# EasyEDA Pro project ProProject_校电赛c题第二版_2024-10-13.epro, board _1
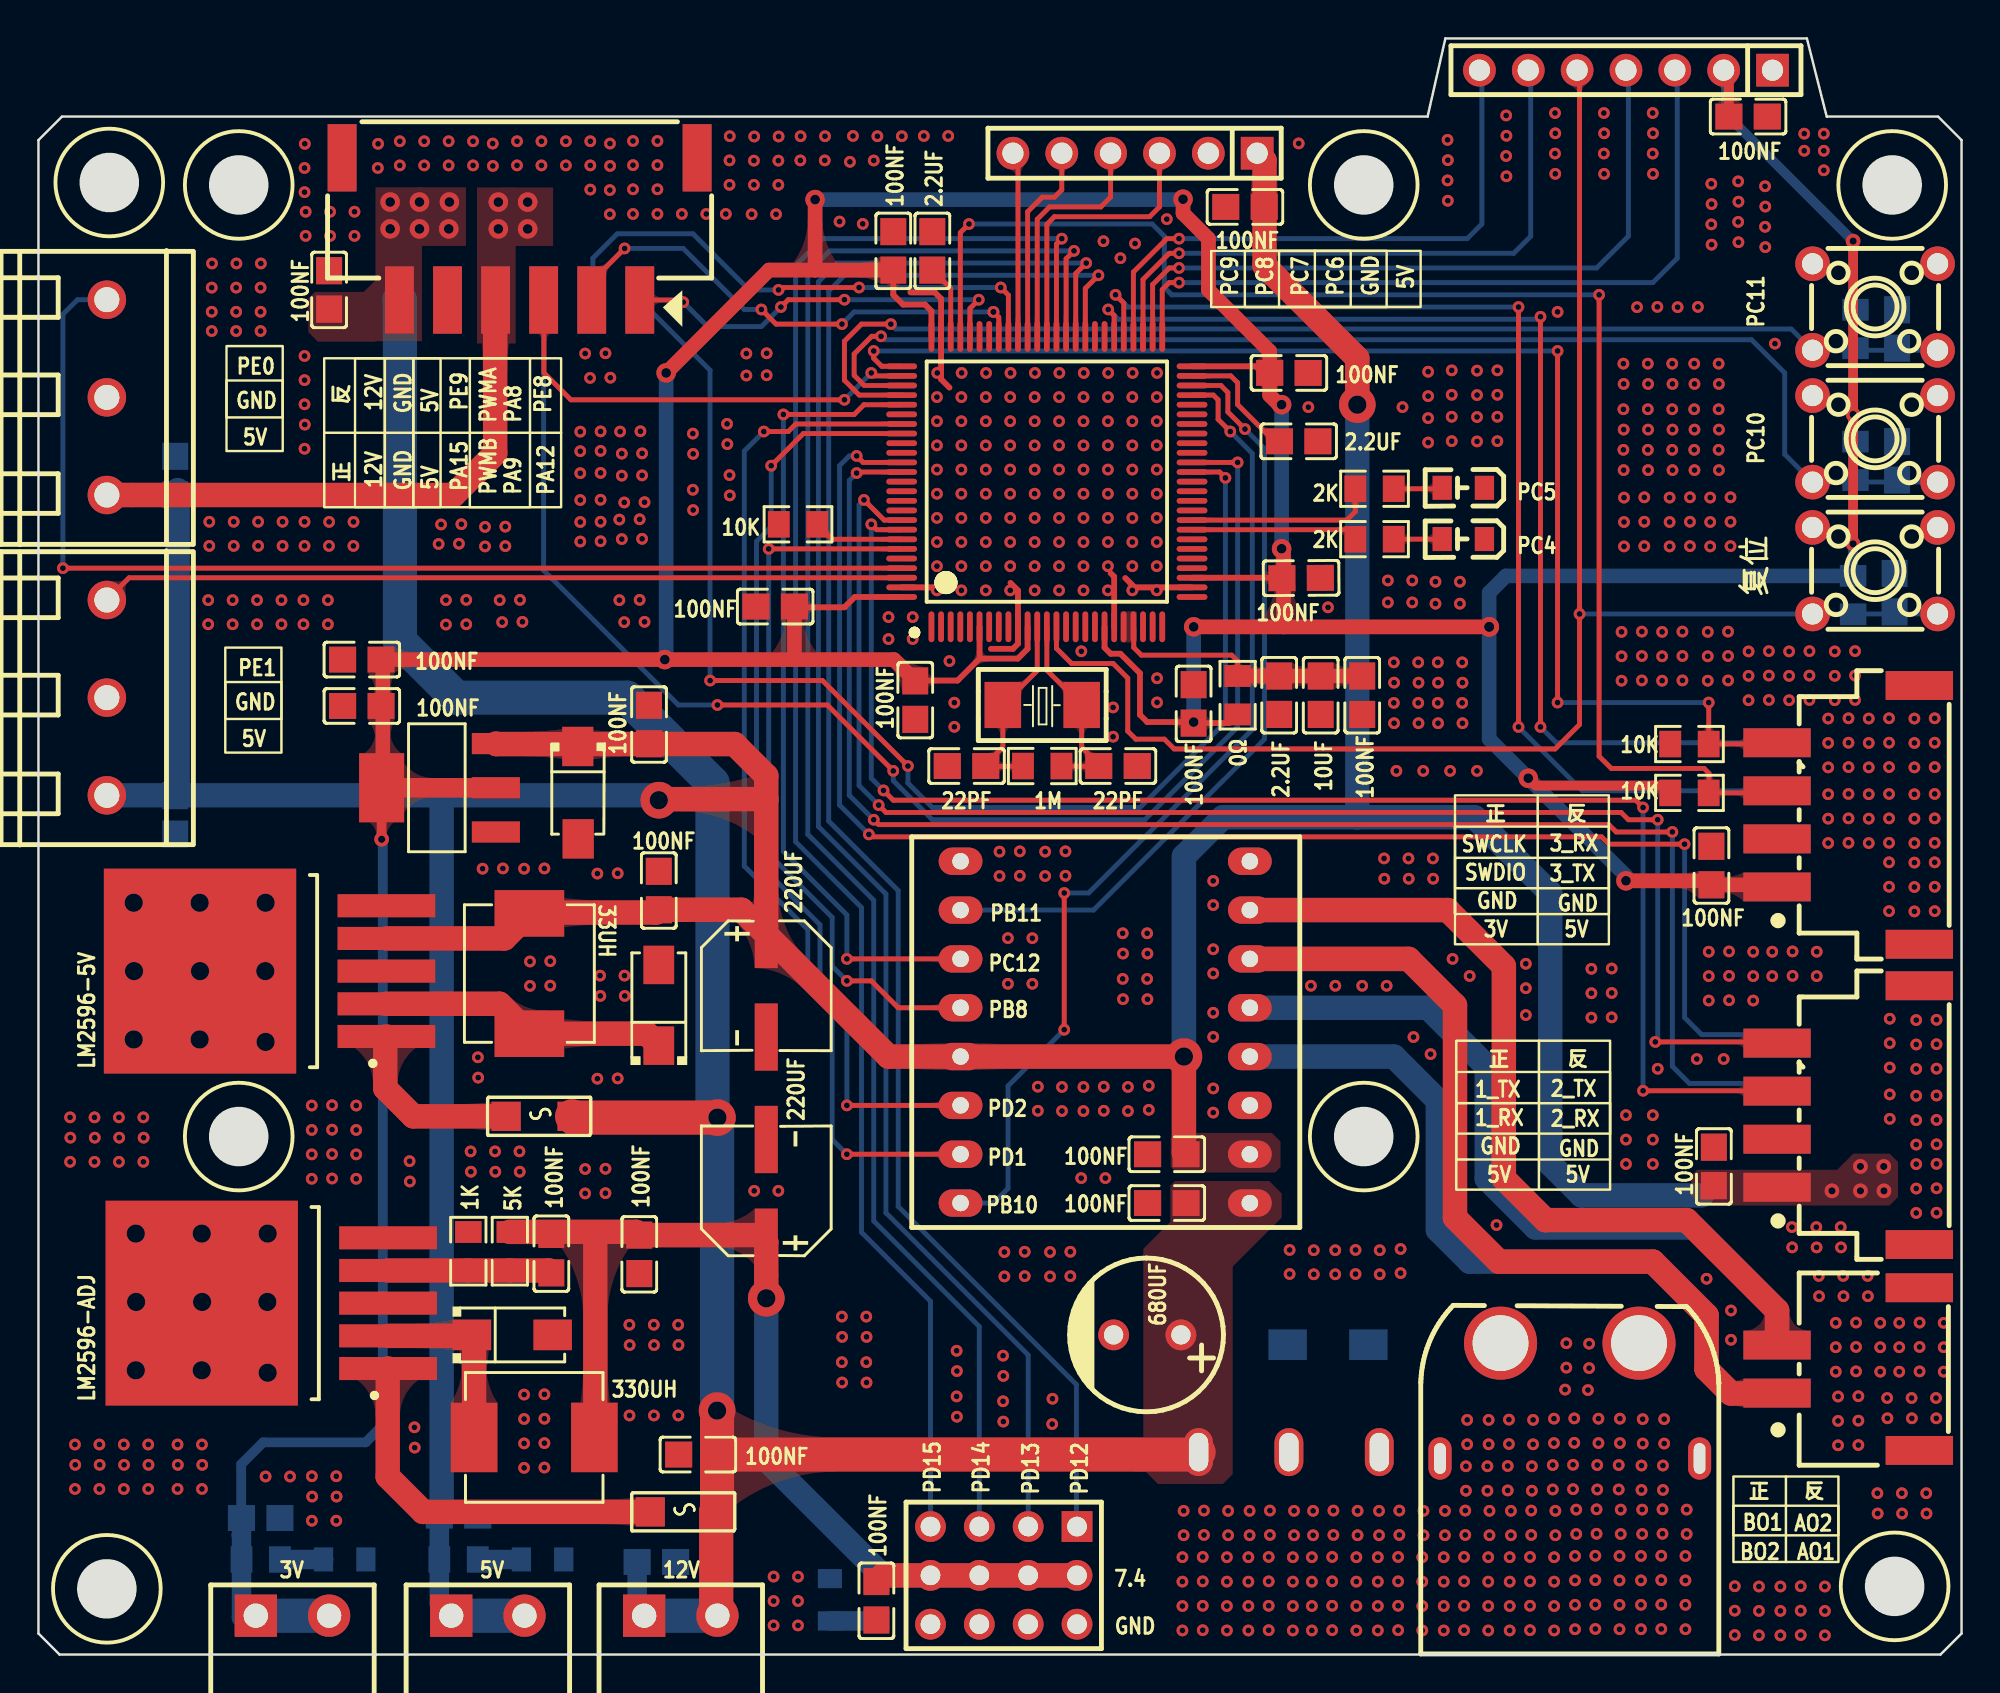
[diagram p0: board, top side]
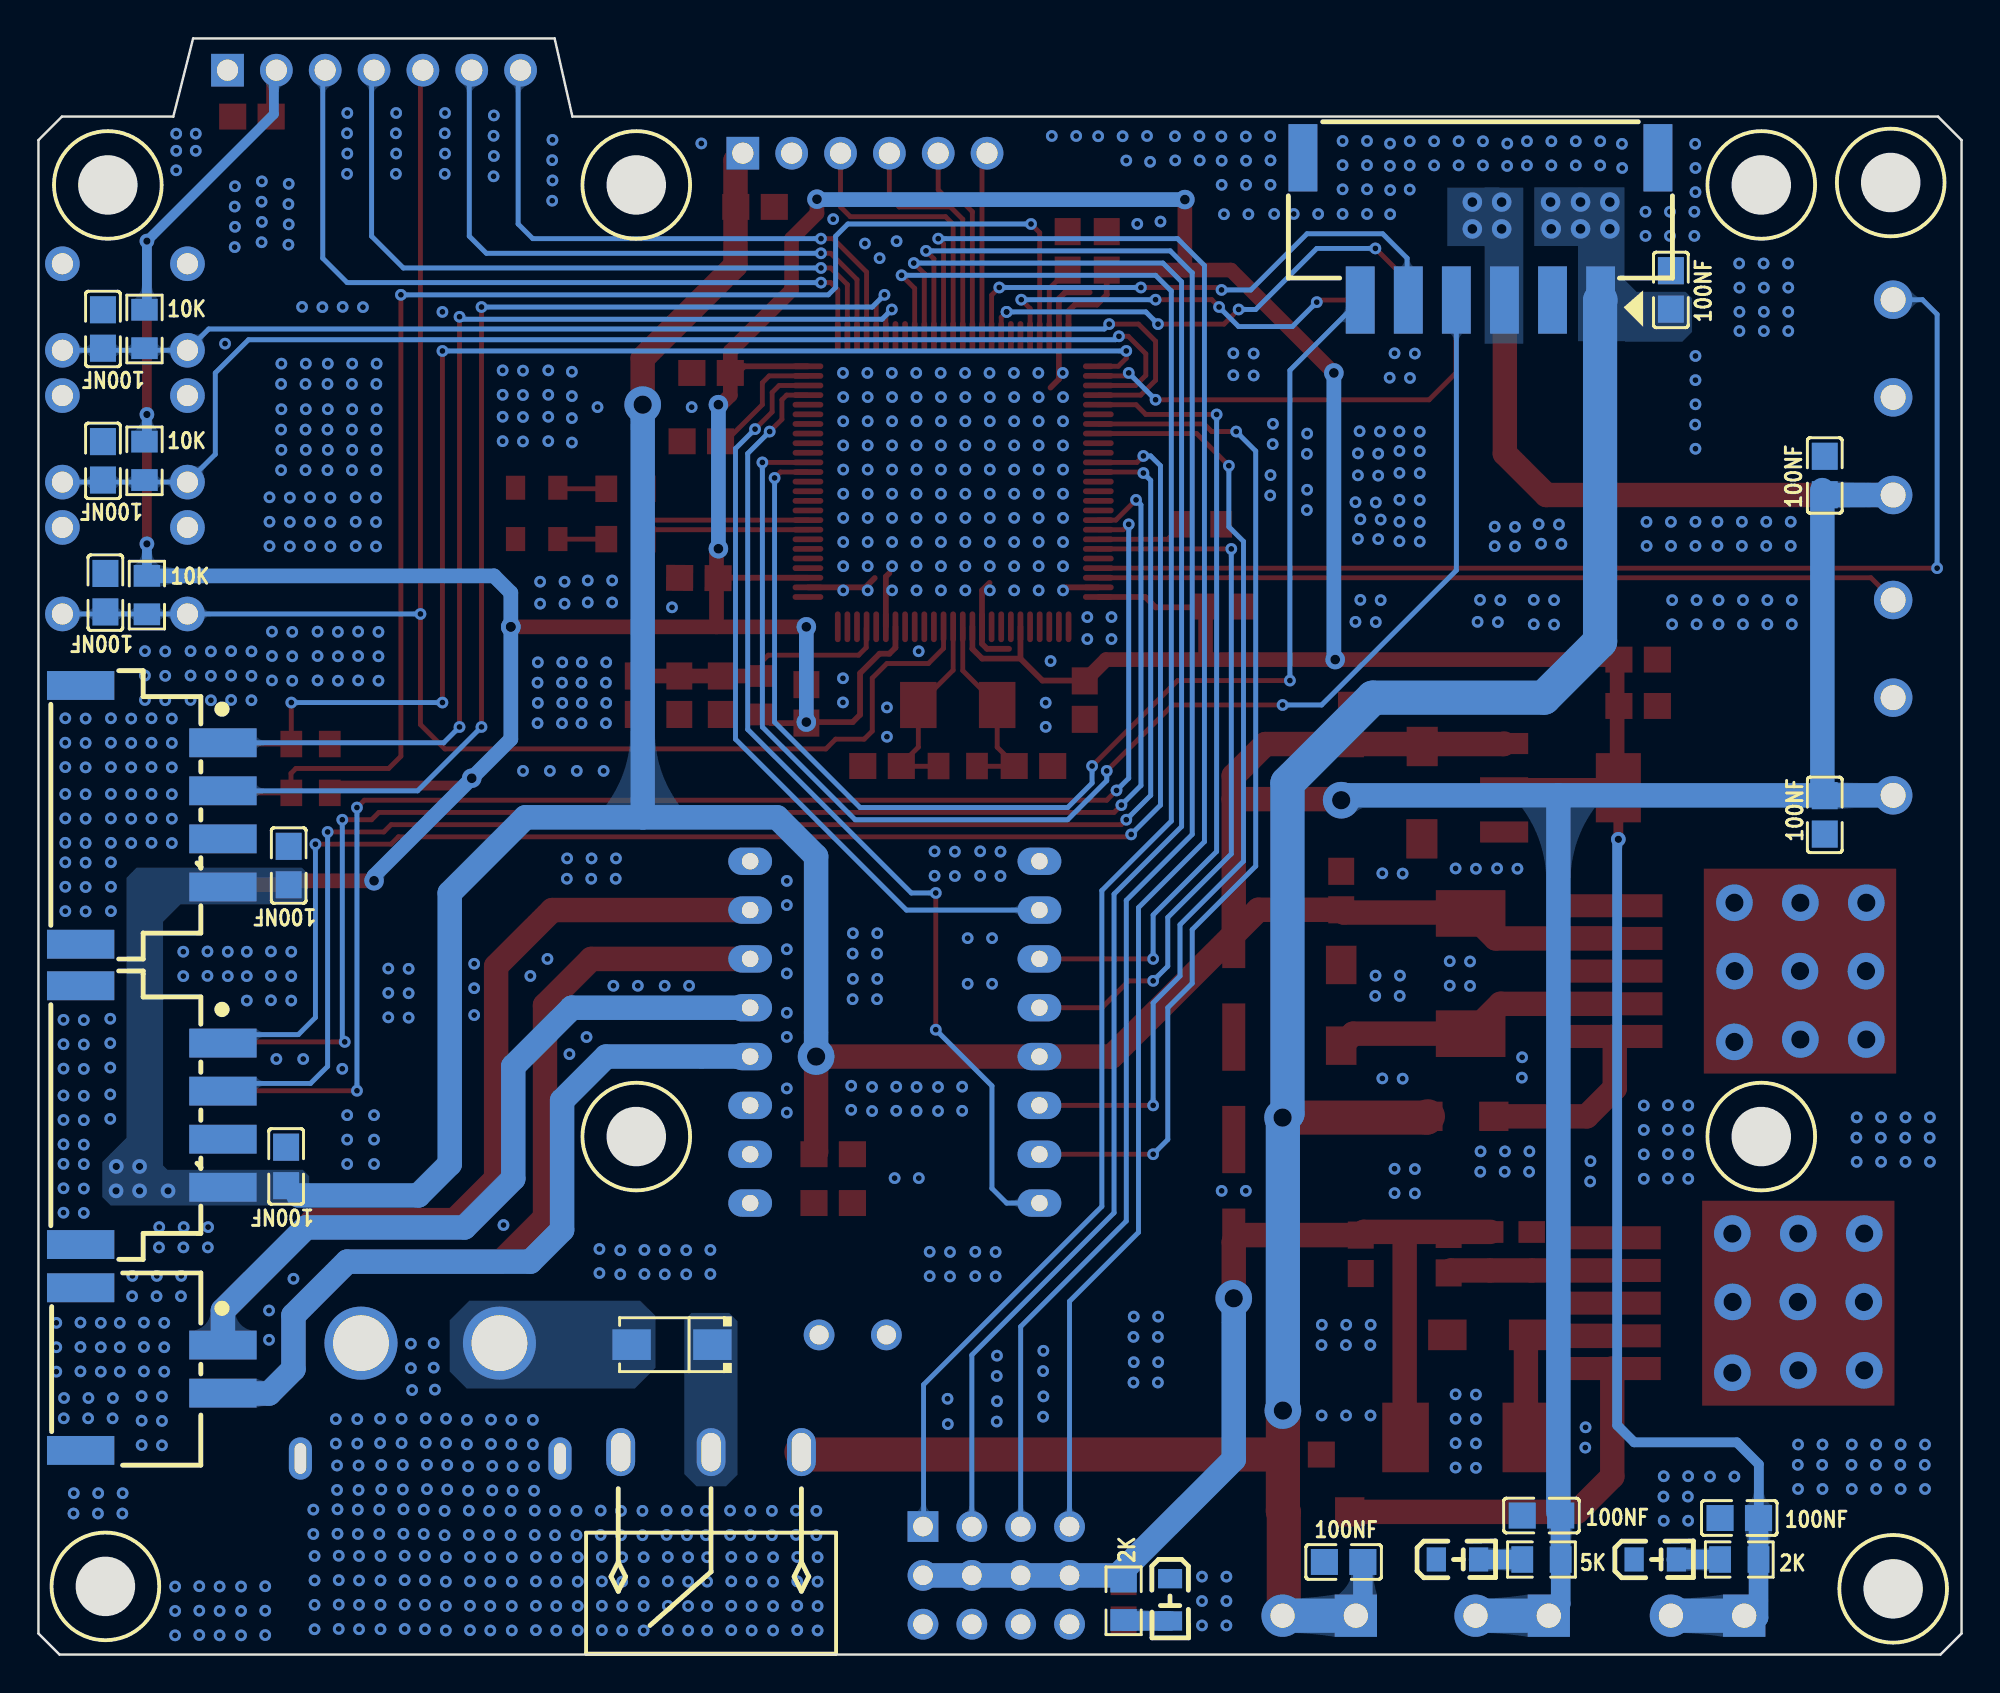
[diagram p1: board, bottom side, seen from below]

Outline 100 x 84.06 mm; copper layers: Top Layer, Bottom Layer. Coordinates in mm from the lower left corner of the outline.
Outline path: 0,78.78 1.22,80 72.24,80 73.16,84.06 91.96,84.06 92.99,80 98.78,80 100,78.78 100,1.09 98.91,0 1.09,0 0,1.09 0,78.78
Stack: Top Layer 0.035mm / Dielectric1 1.51mm FR4 er 4.5 / Bottom Layer 0.035mm

## Design rules (mm)
template: JLCPCB Capability(Two Layers Board)
spacing copperThickness1oz (default): track to track 0.102, other pairs 0.152 to 0.3
spacing copperThickness2oz: track to track 0.203, other pairs 0.152 to 0.3
track width copperThickness1oz (default): min 0.127, default 0.254, max 2.54
track width copperThickness2oz: min 0.203, default 0.254, max 2.54
differential pair differentialPair (default): width min 0.127, default 0.254, max 2.54; gap min 0.152, default 0.152
via viaSize (default): diameter min 0.5, default 0.61, max 10; hole min 0.3, default 0.305, max 6.3

## Placement (name value [footprint] x y rotation side)
0  0  [R0805]  62.36 49.9 90 top
1K1  1K  [R0805]  22.35 20.98 270 top
1M  1M  [R0805]  52.2 46.22 0 top
2  LM2596-5V  [lm2596]  15.02 34.92 180 top
2.2u  -  [C0805]  46.48 73.02 270 top
2.2u#2  -  [C0805]  65.53 63.11 180 top
2.2u#3  -  [C0805]  64.52 49.9 90 top
2K  -  [R0805]  69.47 60.64 0 top
2K1  2k  [R0805]  43.57 2.8 270 bottom
2K#2  -  [R0805]  69.47 58.02 0 top
2K#3  -  [R0805]  11.56 4.94 0 bottom
5  LM2596-ADJ  [lm2596-adj]  13.84 18.41 180 top
5K  5k  [R0805]  21.84 4.94 0 bottom
5K1  5K  [R0805]  24.51 20.98 90 top
10k  -  [R0805]  85.85 44.82 180 top
10K  10K  [R0805]  39.5 58.79 180 top
10k1  10K  [R0805]  94.36 55.11 270 bottom
10K5  10K  [R0805]  94.49 62.09 270 bottom
10K6  10K  [R0805]  94.49 68.95 270 bottom
10k#2  -  [R0805]  85.85 47.36 180 top
22p  -  [C0805]  48.26 46.22 0 top
22p#2  -  [C0805]  56.13 46.22 180 top
33uH1  33uH  [IND-SMD_L7.0-W6.6_FXL0630]  25.53 35.42 270 top
33uH2  330uH  [IND-SMD_L7.0-W6.6_FXL0630]  25.78 11.29 180 top
100nf  -  [C0805]  62.74 75.3 180 top
100NF  -  [C0805]  68.83 49.9 90 top
100NF1  100nF  [C0805]  32.13 4.82 180 bottom
100nf7  100nF  [C0805]  16.82 51.75 0 top
100nf8  100nF  [C0805]  32.26 39.74 270 top
100nf9  100nF  [C0805]  34.29 10.4 0 top
100nf10  100nF  [C0805]  26.67 20.85 90 top
100nf11  100nF  [C0805]  31.24 20.82 90 top
100nf13  100nF  [C0805]  58.67 23.48 180 top
100NF13  100nF  [C0805]  96.65 62.09 90 bottom
100nf14  100nF  [C0805]  58.67 26.03 180 top
100NF14  100nF  [C0805]  96.65 68.95 90 bottom
100NF15  100nF  [C0805]  88.9 80 180 top
100nf15  100nF  [C0805]  7.11 61.33 90 bottom
100nf16  100nF  [C0805]  43.57 2.8 90 top
100nf20  100nF  [C0805]  31.75 48.38 270 top
100nf21  10UF  [C0805]  16.82 49.34 0 top
100nf22  100nF  [C0805]  7.11 43.68 90 bottom
100nf#2  -  [C0805]  87.12 25.39 90 top
100NF#2  -  [C0805]  96.52 55.23 90 bottom
100nf#3  -  [C0805]  87 41.04 90 top
100NF#3  -  [C0805]  87.12 25.39 270 bottom
100nf#4  -  [C0805]  38.31 54.51 180 top
100NF#4  -  [C0805]  86.99 41.04 270 bottom
100nf#5  -  [C0805]  44.45 73.02 90 top
100NF#5  -  [C0805]  11.56 7.1 180 bottom
100nf#6  -  [C0805]  45.59 49.65 270 top
100NF#6  -  [C0805]  21.84 7.23 180 bottom
100nf#7  -  [C0805]  15.11 70.98 90 top
100nf#8  -  [C0805]  60.07 49.45 90 top
100nf#9  -  [C0805]  65.66 56 180.4 top
100nf#10  -  [C0805]  15.11 70.98 90 bottom
106  106  [C0805]  66.68 49.9 90 top
677  STM32F407V  [lqfp-100_l14.0-w14.0-p0.50-ls16.0-bl]  52.44 61.01 0 top
C37  100nF  [C0805]  65.02 66.67 0 top
C39  220UF  [CAP-SMD_BD6.3-L6.6-W6.6-FD]  37.85 34.79 270 top
C40  220UF  [CAP-SMD_BD6.3-L6.6-W6.6-FD]  37.85 24.12 90 top
C43  680uF  [CAP-TH_BD8.0-P3.50-D0.5-FD]  57.66 16.63 180 top
CN4  WAFER-254W-4A  [CONN-SMD_4P-P2.50-WAFER-254W-4P]  94.11 43.68 90 top
CN15  WAFER-254W-4A  [CONN-SMD_4P-P2.50-WAFER-254W-4P]  94.11 28.06 90 top
CN16  XT60PW-M  [CONN-TH_XT60PW-M]  79.63 13.2 90 top
CN17  WAFER-254W-4A  [CONN-SMD_4P-P2.50-WAFER-254W-4P]  94.11 43.68 270 bottom
CN18  WAFER-254W-4A  [CONN-SMD_4P-P2.50-WAFER-254W-4P]  94.11 28.06 270 bottom
CN19  ZX-XH2.54-2PWT  [CONN-SMD_2P-P2.54_MEGASTAR_ZX-XH2.54-2PWT]  94.11 14.85 270 bottom
CN20  ZX-XH2.54-2PWT  [CONN-SMD_2P-P2.54_MEGASTAR_ZX-XH2.54-2PWT]  94.11 14.85 90 top
D1  SS54  [SMA_L4.3-W2.6-LS5.0-RD]  28.06 44.83 270 top
FU1  3A  [3a熔断器]  26.04 27.8 180 top
FU2  3A  [3a熔断器]  33.53 7.23 180 top
H10  -  [HDR-TH_7P-P2.54-V-M]  82.55 82.41 180 top
H11  PZ254V-11-06P  [HDR-TH_6P-P2.54-V-M]  57.02 78.09 180 top
LED1  -  [LED_0805]  15.88 4.94 180 bottom
LED2  -  [LED_0805]  26.16 4.94 180 bottom
LED3  -  [LED_0805]  41.16 2.8 270 bottom
P1  WJ500V-5.08-3P  [CONN-TH_3P-P5.00_WJ500V-5.08-3P]  3.56 65.39 270 top
P2  WJ500V-5.08-3P  [CONN-TH_3P-P5.00_WJ500V-5.08-3P]  3.56 49.77 270 top
P3  WJ15EDGRC-3.81-2P  [CONN-TH_2P-P3.81_WJ15EDGRC-3.81-2P]  33.4 2.02 0 top
P4  WJ15EDGRC-3.81-2P  [CONN-TH_2P-P3.81_WJ15EDGRC-3.81-2P]  23.37 2.02 0 top
P5  WJ15EDGRC-3.81-2P  [CONN-TH_2P-P3.81_WJ15EDGRC-3.81-2P]  13.21 2.02 0 top
PC4  -  [LED_0805]  74.04 58.03 180 top
PC5  -  [LED_0805]  74.04 60.7 180 top
RESET1  K2-1102DP-C4SW-04  [KEY-TH_4P-L6.0-W6.0-P4.50-LS6.5]  95.5 56.38 0 top
RESET2  K2-1102DP-C4SW-04  [KEY-TH_4P-L6.0-W6.0-P4.50-LS6.5]  95.5 63.24 0 top
RESET3  K2-1102DP-C4SW-04  [KEY-TH_4P-L6.0-W6.0-P4.50-LS6.5]  95.5 70.09 0 top
S1  单刀双掷  [弯]  65.02 3.04 90 bottom
SS1  SS34  [SMA_L4.3-W2.5-LS5.0-RD]  67.06 16.12 0 bottom
ss34  SS34  [SMA_L4.3-W2.5-LS5.0-RD]  24.64 16.63 0 top
SS34  SS34  [SMA_L4.3-W2.5-LS5.0-RD]  32.26 33.77 90 top
TB2  TB6612-MOD  [tb6612fng封装]  55.5 32.38 180 top
TP1  M3铜柱带丝印  [M3铜柱]  3.56 3.42 0 top
TP2  M3铜柱带丝印  [M3铜柱]  3.68 76.57 0 top
TP3  M3铜柱带丝印  [M3铜柱]  96.39 76.44 0 top
TP4  M3铜柱带丝印  [M3铜柱]  96.52 3.55 0 top
TP5  M3铜柱带丝印  [M3铜柱]  10.41 26.94 0 top
TP6  M3铜柱带丝印  [M3铜柱]  68.91 76.44 0 top
TP7  M3铜柱带丝印  [M3铜柱]  68.91 26.94 0 top
TP8  M3铜柱带丝印  [M3铜柱]  10.41 76.44 0 top
U5  AMS1117-3.3  [SOT-223-3_L6.5-W3.4-P2.30-LS7.0-BR]  20.82 45.09 0 top
U6  KH-2.54PH180-3X4P-L11.5  [HDR-TH-12P-P2.54-V-M-R3-C4-S5.08]  50.19 4.12 180 top
X1  8MHz  [CRYSTAL-SMD_L5.0-W3.2]  52.2 49.39 0 top
电机A2  BX-XH2.54-6PWT  [CONN-SMD_6P-P2.50_BX-XH2.54-6PWT]  25.02 74.16 0 bottom
电机A3  BX-XH2.54-6PWT  [CONN-SMD_6P-P2.50_BX-XH2.54-6PWT]  25.02 74.16 180 top

## Footprints (pads in the part's own frame, mm; a bottom-side part is the same pattern mirrored in y, then rotated)
3a熔断器
  rect 1.524x1.524 smd: 1(-1.714,-0.194) 2(1.714,-0.194)
C0805
  rect 1.41x1.35 smd: 1(-1,0) 2(1,0)
CAP-SMD_BD6.3-L6.6-W6.6-FD
  rect 3.5x1.2 smd: 1(-2.67,0) 2(2.67,0)
CAP-TH_BD8.0-P3.50-D0.5-FD
  round 1.6 hole 1: 1(-1.75,0) 2(1.75,0)
CONN-SMD_2P-P2.54_MEGASTAR_ZX-XH2.54-2PWT
  rect 1.5x3.5 smd: 1(-1.25,3.7) 2(1.25,3.7) 3(-4.23,-3.7) 4(4.23,-3.7)
CONN-SMD_4P-P2.50-WAFER-254W-4P
  rect 1.5x3.5 smd: 1(-3.75,3.7) 2(-1.25,3.7) 3(1.25,3.7) 4(3.75,3.7) 5(-6.73,-3.7) 6(6.73,-3.7)
CONN-SMD_6P-P2.50_BX-XH2.54-6PWT
  rect 1.5x3.5 smd: 1(-6.25,3.7) 2(-3.75,3.7) 3(-1.25,3.7) 4(1.25,3.7) 5(3.75,3.7) 6(6.25,3.7) 7(9.23,-3.7) 8(-9.23,-3.7)
CONN-TH_2P-P3.81_WJ15EDGRC-3.81-2P
  rect 2.2x2.2 hole 1.26: 1(-1.905,0)
  round 2.2 hole 1.26: 2(1.905,0)
CONN-TH_3P-P5.00_WJ500V-5.08-3P
  round 2 hole 1.3: 1(-5.08,0) 2(0,0) 3(5.08,0)
CONN-TH_XT60PW-M
  round 3.8 hole 2.9: 1(3,-3.6) 2(3,3.6)
  oval 2.2x1.2 hole 1.6x0.6: 3(-3,6.75) 4(-3,-6.75)
CRYSTAL-SMD_L5.0-W3.2
  rect 1.9x2.4 smd: 1(-2.05,0) 2(2.05,0)
HDR-TH-12P-P2.54-V-M-R3-C4-S5.08
  rect 1.6x1.6 hole 1.02: 1(-3.81,-2.54)
  round 1.6 hole 1.02: 2(-3.81,0) 3(-3.81,2.54) 4(-1.27,-2.54) 5(-1.27,0) 6(-1.27,2.54) 7(1.27,-2.54) 8(1.27,0) 9(1.27,2.54) 10(3.81,-2.54) 11(3.81,0) 12(3.81,2.54)
HDR-TH_6P-P2.54-V-M
  rect 1.7x1.7 hole 1.1: 1(-6.35,0)
  round 1.7 hole 1.1: 2(-3.81,0) 3(-1.27,0) 4(1.27,0) 5(3.81,0) 6(6.35,0)
HDR-TH_7P-P2.54-V-M
  rect 1.7x1.7 hole 1.1: 1(-7.62,0)
  round 1.7 hole 1.1: 2(-5.08,0) 3(-2.54,0) 4(0,0) 5(2.54,0) 6(5.08,0) 7(7.62,0)
IND-SMD_L7.0-W6.6_FXL0630
  rect 2.424x3.62 smd: 1(3.128,0) 2(-3.128,0)
KEY-TH_4P-L6.0-W6.0-P4.50-LS6.5
  round 1.8 hole 1.1: 1(-3.251,-2.251) 2(3.251,-2.251) 3(3.251,2.251) 4(-3.251,2.251)
LED_0805
  rect 1x1.25 smd: 1(-1.15,0.005) 2(1.05,0.005)
lm2596
  rect 5.08x1.2 smd: 1(-3.067,2.765) 2(-3.067,1.065) 3(-3.067,-0.635) 4(-3.067,-2.335) 5(-3.067,-4.035)
  rect 10x10.66 smd: 3(6.623,-0.635)
lm2596-adj
  rect 5.08x1.2 smd: 1(-4.337,3.527) 2(-4.337,1.827) 3(-4.337,0.127) 4(-4.337,-1.573) 5(-4.337,-3.273)
  rect 10x10.66 smd: 3(5.353,0.127)
lqfp-100_l14.0-w14.0-p0.50-ls16.0-bl
  oval 0.3x1.6 smd: 1(-6,-7.55) 2(-5.5,-7.55) 3(-5,-7.55) 4(-4.5,-7.55) 5(-4,-7.55) 6(-3.5,-7.55) 7(-3,-7.55) 8(-2.5,-7.55) 9(-2,-7.55) 10(-1.5,-7.55) 11(-1,-7.55) 12(-0.5,-7.55) 13(0,-7.55) 14(0.5,-7.55) 15(1,-7.55) 16(1.5,-7.55) 17(2,-7.55) 18(2.5,-7.55) 19(3,-7.55) 20(3.5,-7.55) 21(4,-7.55) 22(4.5,-7.55) 23(5,-7.55) 24(5.5,-7.55) 25(6,-7.55) 51(6,7.55) 52(5.5,7.55) 53(5,7.55) 54(4.5,7.55) 55(4,7.55) 56(3.5,7.55) 57(3,7.55) 58(2.5,7.55) 59(2,7.55) 60(1.5,7.55) 61(1,7.55) 62(0.5,7.55) 63(0,7.55) 64(-0.5,7.55) 65(-1,7.55) 66(-1.5,7.55) 67(-2,7.55) 68(-2.5,7.55) 69(-3,7.55) 70(-3.5,7.55) 71(-4,7.55) 72(-4.5,7.55) 73(-5,7.55) 74(-5.5,7.55) 75(-6,7.55)
  oval 1.6x0.3 smd: 26(7.55,-6) 27(7.55,-5.5) 28(7.55,-5) 29(7.55,-4.5) 30(7.55,-4) 31(7.55,-3.5) 32(7.55,-3) 33(7.55,-2.5) 34(7.55,-2) 35(7.55,-1.5) 36(7.55,-1) 37(7.55,-0.5) 38(7.55,0) 39(7.55,0.5) 40(7.55,1) 41(7.55,1.5) 42(7.55,2) 43(7.55,2.5) 44(7.55,3) 45(7.55,3.5) 46(7.55,4) 47(7.55,4.5) 48(7.55,5) 49(7.55,5.5) 50(7.55,6) 76(-7.55,6) 77(-7.55,5.5) 78(-7.55,5) 79(-7.55,4.5) 80(-7.55,4) 81(-7.55,3.5) 82(-7.55,3) 83(-7.55,2.5) 84(-7.55,2) 85(-7.55,1.5) 86(-7.55,1) 87(-7.55,0.5) 88(-7.55,0) 89(-7.55,-0.5) 90(-7.55,-1) 91(-7.55,-1.5) 92(-7.55,-2) 93(-7.55,-2.5) 94(-7.55,-3) 95(-7.55,-3.5) 96(-7.55,-4) 97(-7.55,-4.5) 98(-7.55,-5) 99(-7.55,-5.5) 100(-7.55,-6)
R0805
  rect 1.133x1.377 smd: 1(-1,0) 2(1,0)
SMA_L4.3-W2.5-LS5.0-RD
  rect 2x1.593 smd: 1(-2.1,0) 2(2.1,0)
SMA_L4.3-W2.6-LS5.0-RD
  rect 2.047x1.621 smd: 1(-2.403,-0.01) 2(2.403,0.01)
SOT-223-3_L6.5-W3.4-P2.30-LS7.0-BR
  rect 2.5x1.1 smd: 1(2.97,-2.3) 2(2.97,0) 3(2.97,2.3)
  rect 2.34x3.6 smd: 4(-2.97,0)
tb6612fng封装
  oval 2.276x1.423 hole 0.855x0.85: 1(-7.493,8.89) 2(-7.493,6.35) 3(-7.493,3.81) 4(-7.493,1.27) 5(-7.493,-1.27) 6(-7.493,-3.81) 7(-7.493,-6.35) 8(-7.493,-8.89) 9(7.55,-8.89) 10(7.55,-6.35) 11(7.55,-3.81) 12(7.55,-1.27) 13(7.55,1.27) 14(7.55,3.81) 15(7.55,6.35) 16(7.55,8.89)
弯
  rrect 2.5x1.5 hole 2x1: 1(7.493,4.699) 2(7.493,0) 3(7.493,-4.699)

## Nets
GND: 1K1.1 2.3 2.5 2.2u.1 2.2u#2.1 2.2u#3.1 5.3 5.5 10K.2 10k#2.2 22p.1 22p#2.1 100NF.1 100nf.2 100NF1.1 100nf7.1 100nf8.1 100nf9.1 100nf11.1 100nf13.2 100NF13.2 100nf14.2 100NF14.2 100NF15.1 100nf15.2 100nf16.1 100nf20.1 100nf21.1 100nf22.1 100nf#2.2 100NF#2.2 100NF#3.1 100nf#3.2 100NF#4.1 100nf#4.2 100NF#5.1 100nf#5.2 100NF#6.1 100nf#6.2 100nf#7.2 100nf#8.2 100nf#9.1 100nf#10.2 106.1 677.10 677.20 677.27 677.74 677.99 C37.2 C39.2 C40.2 C43.2 CN4.2 CN15.2 CN16.1 CN16.3 CN16.4 CN17.3 CN18.3 D1.2 H10.1 H11.2 LED1.1 LED2.1 LED3.1 P1.2 P2.2 PC4.1 PC5.1 RESET1.3 RESET1.4 RESET2.3 RESET2.4 RESET3.3 RESET3.4 ss34.2 SS34.2 TB2.3 TB2.8 TB2.9 U5.1 U6.3 U6.6 U6.9 U6.12 电机A2.2 电机A3.5
VCC3V: 0.1 2K#3.1 10k.2 10k1.1 10K5.1 10K6.1 100nf7.2 100NF15.2 100nf21.2 100nf#3.1 100nf#4.1 100nf#5.1 100NF#5.2 100nf#6.1 100nf#8.1 100nf#9.2 677.6 677.11 677.19 677.28 677.50 677.75 677.100 C37.1 CN4.1 H10.2 P5.1 P5.2 U5.2 U5.4
VCC5V: 2.4 5K.1 33uH1.2 100nf.1 100nf8.2 100nf14.1 100nf15.1 100nf20.2 100nf22.2 100nf#2.1 100NF#3.2 100NF#4.2 100NF#6.2 C39.1 CN15.1 CN17.4 CN18.4 D1.1 H11.1 P1.3 P2.3 P4.1 P4.2 TB2.2 TB2.13 U5.3 电机A2.3 电机A3.4
VCC7.4V: 2K1.1 5K1.2 33uH2.2 100nf10.2 100nf11.2 100nf16.2 C40.1 U6.2 U6.5 U6.8 U6.11
VCC12V: 100NF1.2 100nf9.2 100nf13.1 100nf#7.1 100nf#10.1 C43.1 FU1.1 FU2.1 P3.1 P3.2 S1.3 TB2.1 电机A2.1 电机A3.6
AO1: CN19.2 TB2.4
AO2: CN19.1 TB2.5
BO1: CN20.2 TB2.7
BO2: CN20.1 TB2.6
LED2_PC4: 2K#2.1 677.33
LED3_PC5: 2K.1 677.34
OSC_IN: 1M.1 22p.2 677.12 X1.1
OSC_OUT: 1M.2 22p#2.2 677.13 X1.2
PA12: 677.71 电机A3.1
PA15: 677.77 电机A3.3
PB8: 677.95 TB2.12
PB10: 677.47 TB2.16
PB11: 677.48 TB2.10
PB51: 677.51 H10.3
PB52: 677.52 H10.4
PB53: 677.53 H10.6
PB54: 677.54 H10.7
PC6: 677.63 H11.3
PC7: 677.64 H11.4
PC8: 677.65 H11.5
PC9: 677.66 H11.6
PC10: 10K5.2 100NF13.1 677.78 RESET2.1 RESET2.2
PC11: 10K6.2 100NF14.1 677.79 RESET3.1 RESET3.2
PC12: 677.80 TB2.11
PD1: 677.82 TB2.15
PD2: 677.83 TB2.14
PE0: 677.97 P1.1
PE1: 677.98 P2.1
PE2: 677.1
PE8: 677.39 电机A2.6
PE9: 677.40 电机A2.4
POWER12V: S1.2 SS1.1
PWMA: 677.67 电机A2.5
PWMB: 677.68 电机A3.2
RESET: 10k1.2 100NF#2.1 677.14 H10.5 RESET1.1 RESET1.2
STEER1: 677.59 U6.1
STEER2: 677.60 U6.4
STEER3: 677.61 U6.7
STEER4: 677.62 U6.10
SWCLK: 10k#2.1 677.76 CN4.4
SWDIO: 10k.1 677.72 CN4.3
USART1_RX: 677.93 CN15.3
USART1_TX: 677.92 CN15.4
USART2_RX: 677.87 CN18.2
USART2_TX: 677.86 CN18.1
USART3_RX: 677.56 CN17.1
USART3_TX: 677.55 CN17.2
$1N4136: 677.5
$1N4138: 677.4
$1N4142: 677.2
$1N4162: 677.96
$1N4170: 677.91
$1N4172: 677.90
$1N4174: 677.89
$1N4178: 677.36
$1N4180: 677.35
$1N4186: 677.70
$1N4188: 677.69
$1N4194: 677.32
$1N4196: 677.31
$1N4198: 677.30
$1N4200: 677.29
$1N4202: 677.26
$1N4204: 677.25
$1N4206: 677.24
$1N4208: 677.23
$1N4210: 677.46
$1N4212: 677.45
$1N4214: 677.44
$1N4216: 677.43
$1N4222: 677.7
$1N4242: 677.17
$1N4244: 677.16
$1N4246: 677.15
$1N4256: 677.58
$1N4258: 677.57
$1N4264: 677.88
$1N4270: 677.85
$1N4276: 677.81
$1N4303: 5K.2 LED2.2
$1N4305: 2K#3.2 LED1.2
$1N4501: 2K.2 PC5.2
$1N4502: 2K#2.2 PC4.2
$1N4519: 677.41
$1N4521: 677.42
$1N4523: 677.18
$1N4552: 0.2 2.2u#3.2 100NF.2 106.2 677.21 677.22
$1N4554: 2.2u.2 677.73
$1N4555: 2.2u#2.2 677.49
$1N11019: 10K.1 677.94
$1N11427: 677.38
$1N28449: 2.1 FU1.2
$1N28458: 2.2 33uH1.1 SS34.1
$1N28460: 5.1 FU2.2
$1N28462: 1K1.2 5.4 5K1.1 100nf10.1
$1N28463: 5.2 33uH2.1 ss34.1
$1N28468: CN16.2 SS1.2
$1N28554: 2K1.2 LED3.2

Pads without a net: 677 3 8 9 37 84; CN4 5 6; CN15 5 6; CN17 5 6; CN18 5 6; CN19 3 4; CN20 3 4; S1 1; 电机A2 7 8; 电机A3 7 8

## Via types
v1: diameter 0.61, hole 0.305, Top Layer to Bottom Layer, 1092 vias
v2: diameter 1.905, hole 0.953, Top Layer to Bottom Layer, 24 vias
v3: diameter 1.016, hole 0.508, Top Layer to Bottom Layer, 22 vias
v4: diameter 0.762, hole 0.381, Top Layer to Bottom Layer, 9 vias

## Routing (per net, layer and track width the routed paths; a pad name or vN(x,y) marks a point on that pad's centre or on a via; arc(x,y) is an arc through that point)
GND: length 19.8
  Top Layer w0.299: v1(46.72,55.36) 46.57,55.51 677.99 ; 677.27 57,55.51 56.52,56 ; 50.55,55.74 50.94,55.35 50.94,52.58 50.67,52.31 49.53,52.31 ; 47.37,65.9 46.94,66.34 677.74 46.94,70.53 46.61,70.86 45.34,70.86 ; 55.94,53.46 55.94,56.07 55.75,56.25
  vias: v1(1.64,27.94) v1(1.66,26.89) v1(1.64,25.63) v1(1.9,10.93) v1(1.91,9.87) v1(1.9,8.61) v1(2.91,27.94) v1(2.93,26.89) v1(2.91,25.63) v1(3.17,10.93) v1(3.18,9.87) v1(3.17,8.61) v1(4.18,27.94) v1(4.18,25.63) v1(4.2,26.89) v1(4.44,10.93) v1(4.45,9.87) v1(4.44,8.61) v1(5.45,27.94) v1(5.47,26.89) v1(5.45,25.63) v1(5.71,10.93) v1(5.72,9.87) v1(5.71,8.61) v1(7.23,10.93) v1(7.25,9.87) v1(7.23,8.61) v1(8.5,10.93) v1(8.52,9.87) v1(8.5,8.61) v1(8.88,58.92) v1(8.88,57.67) v1(8.83,54.85) v1(8.83,53.59) v1(9.02,72.36) v1(9.01,71.1) v1(9.01,69.85) v1(9.01,68.84) v1(10.15,58.92) v1(10.15,57.67) v1(10.1,54.85) v1(10.1,53.59) v1(10.28,71.1) v1(10.28,69.85) v1(10.28,68.84) v1(10.29,72.36) v1(11.37,54.85) v1(11.37,53.59) v1(11.42,58.92) v1(11.42,57.67) v1(11.56,72.36) v1(11.55,71.1) v1(11.55,69.85) v1(11.55,68.84) v1(11.81,9.26) v1(12.64,54.85) v1(12.64,53.59) v1(12.69,58.92) v1(12.69,57.67) v1(13.08,9.26) v1(13.78,54.85) v1(13.78,53.59) v1(13.85,78.58) v1(13.84,77.33) v1(13.84,76.07) v1(13.84,67.55) v1(13.84,66.29) v1(13.84,65.03) v1(13.85,63.98) v1(13.84,62.72) v1(13.84,58.92) v1(13.84,57.67) v1(13.89,75.05) v1(13.89,73.79) v1(14.21,28.56) v1(14.21,27.29) v1(14.21,26.02) v1(14.21,24.75) v1(14.22,9.27) v1(14.23,8.22) v1(14.22,6.96) v1(15.05,54.85) v1(15.05,53.59) v1(15.16,75.05) v1(15.16,73.79) v1(15.11,58.92) v1(15.11,57.67) v1(15.27,28.57) v1(15.27,27.3) v1(15.27,26.03) v1(15.27,24.76) v1(15.49,9.27) v1(15.49,6.96) v1(15.5,8.22) v1(16.38,58.92) v1(16.38,57.67) v1(16.43,75.05) v1(16.43,73.79) v1(16.52,28.56) v1(16.52,27.29) v1(16.52,26.02) v1(16.52,24.75) v1(17.66,78.58) v1(17.65,77.33) v1(18.79,78.72) v1(18.79,77.46) v1(19.3,25.66) v1(19.31,24.61) v1(19.55,11.82) v1(19.56,10.77) v1(20.06,78.72) v1(20.06,77.46) v1(20.81,57.77) v1(20.94,58.78) v1(21.19,54.85) v1(21.19,53.58) v1(21.33,78.72) v1(21.33,77.46) v1(21.86,57.78) v1(21.99,58.8) v1(22.25,54.86) v1(22.25,53.59) v1(22.47,26.17) v1(22.49,25.12) v1(22.6,78.72) v1(22.6,77.46) v1(22.85,31.07) v1(22.87,30.01) v1(23.09,40.88) v1(23.22,58.66) v1(23.22,57.64) v1(23.62,78.6) v1(23.63,77.43) v1(23.74,26.17) v1(23.76,25.12) v1(23.98,54.85) v1(24.11,53.7) v1(24.15,40.89) v1(24.28,58.67) v1(24.28,57.66) v1(24.89,78.72) v1(24.89,77.46) v1(25.04,54.86) v1(25.01,26.17) v1(25.03,25.12) v1(25.17,53.72) v1(25.25,40.88) v1(25.25,13.52) v1(25.25,12.25) v1(25.25,10.98) v1(25.25,9.71) v1(25.56,36.05) v1(25.56,34.78) v1(26.16,78.72) v1(26.16,77.46) v1(26.31,40.89) v1(26.31,13.54) v1(26.31,12.27) v1(26.31,11) v1(26.31,9.73) v1(26.61,36.06) v1(26.61,34.8) v1(27.43,78.72) v1(27.43,77.46) v1(28.17,63.61) v1(28.17,62.59) v1(28.17,61.45) v1(28.17,60.05) v1(28.17,58.91) v1(28.17,57.89) v1(28.43,67.67) v1(28.43,25.26) v1(28.43,23.99) v1(28.68,66.4) v1(28.7,78.72) v1(28.7,77.46) v1(28.7,76.2) v1(29.06,40.62) v1(29.06,29.95) v1(29.23,63.62) v1(29.23,62.61) v1(29.23,61.47) v1(29.23,60.07) v1(29.23,58.92) v1(29.23,57.91) v1(29.2,35.32) v1(29.22,34.26) v1(29.48,67.69) v1(29.48,25.27) v1(29.48,24) v1(29.72,78.6) v1(29.73,77.43) v1(29.71,76.18) v1(29.71,74.92) v1(29.74,66.42) v1(30.12,40.64) v1(30.12,29.97) v1(30.25,63.62) v1(30.21,59.04) v1(30.21,54.85) v1(30.33,62.47) v1(30.33,61.32) v1(30.33,58.02) v1(30.46,59.93) v1(30.46,53.7) v1(30.47,35.32) v1(30.49,34.26) v1(30.73,17.16) v1(30.74,16.1) v1(30.73,12.44) v1(30.92,78.73) v1(30.92,77.47) v1(30.92,76.22) v1(30.92,74.93) v1(31.26,59.05) v1(31.26,54.86) v1(31.3,63.63) v1(31.39,62.48) v1(31.39,61.34) v1(31.39,58.04) v1(31.52,59.94) v1(31.52,53.72) v1(32,17.16) v1(32.01,16.1) v1(32,12.44) v1(32.19,78.73) v1(32.19,77.47) v1(32.19,76.22) v1(32.19,74.93) v1(33.27,17.16) v1(33.28,16.1) v1(33.27,12.44) v1(33.46,74.93) v1(34.03,63.51) v1(34.04,62.45) v1(34.03,60.59) v1(34.04,59.53) v1(34.73,74.93) v1(35.74,74.93) v1(35.81,64.02) v1(35.82,62.96) v1(35.95,78.98) v1(35.93,77.72) v1(35.93,76.45) v1(35.93,61.35) v1(35.95,60.3) v1(36.81,67.67) v1(36.81,66.53) v1(37.08,74.92) v1(37.22,78.96) v1(37.2,77.71) v1(37.2,76.45) v1(37.22,24.12) v1(37.87,67.69) v1(37.87,66.55) v1(38.23,4.05) v1(38.23,2.78) v1(38.23,1.51) v1(38.35,74.92) v1(38.49,78.96) v1(38.47,77.71) v1(38.47,76.45) v1(38.47,24.12) v1(39.5,4.05) v1(39.5,2.78) v1(39.5,1.51) v1(39.63,78.98) v1(39.62,77.72) v1(40.89,77.72) v1(40.9,78.98) v1(41.66,74.54) v1(41.78,17.58) v1(41.78,15.21) v1(41.79,16.52) v1(41.79,14.15) v1(42.2,77.65) v1(42.35,78.99) v1(42.86,74.42) v1(43.05,17.58) v1(43.06,16.52) v1(43.05,15.21) v1(43.06,14.15) v1(43.43,77.71) v1(43.62,78.98) v1(44.2,53.97) v1(44.2,52.82) v1(44.89,78.98) v1(45.46,53.97) v1(45.46,52.82) v1(46.04,78.99) v1(46.74,66.67) v1(46.72,65.41) v1(46.72,64.15) v1(46.72,62.9) v1(46.72,61.64) v1(46.72,60.38) v1(46.72,59.13) v1(46.72,57.87) v1(46.72,56.61) v1(47.31,78.99) v1(47.37,51.68) v1(47.62,49.51) v1(47.62,48.26) v1(47.75,15.8) v1(47.76,14.75) v1(47.75,13.43) v1(47.76,12.37) v1(48.01,66.67) v1(47.99,65.41) v1(47.99,64.15) v1(47.99,62.9) v1(47.99,61.64) v1(47.99,60.38) v1(47.99,59.13) v1(47.99,57.87) v1(47.99,56.61) v1(47.99,55.36) v1(49.28,66.67) v1(49.26,65.41) v1(49.26,64.15) v1(49.26,62.9) v1(49.26,61.64) v1(49.26,60.38) v1(49.26,59.13) v1(49.26,57.87) v1(49.26,56.61) v1(49.26,55.36) v1(49.97,41.77) v1(49.97,40.5) v1(50.16,15.55) v1(50.17,14.49) v1(50.16,13.17) v1(50.17,12.12) v1(50.23,20.94) v1(50.23,19.67) v1(50.41,37.26) v1(50.41,34.89) v1(50.55,66.67) v1(50.53,65.41) v1(50.53,64.15) v1(50.53,62.9) v1(50.53,61.64) v1(50.53,60.38) v1(50.53,59.13) v1(50.53,57.87) v1(50.53,56.61) v1(50.53,55.36) v1(51.03,41.78) v1(51.03,40.51) v1(51.28,20.95) v1(51.28,19.68) v1(51.68,37.26) v1(51.68,34.89) v1(51.82,66.67) v1(51.8,65.41) v1(51.8,64.15) v1(51.8,62.9) v1(51.8,61.64) v1(51.8,60.38) v1(51.8,59.13) v1(51.8,57.87) v1(51.8,56.61) v1(51.8,55.36) v1(51.97,29.54) v1(51.97,28.29) v1(52.35,41.77) v1(52.35,40.5) v1(52.6,20.94) v1(52.6,19.67) v1(52.73,13.31) v1(52.71,11.99) v1(53.09,66.67) v1(53.07,65.41) v1(53.07,64.15) v1(53.07,62.9) v1(53.07,61.64) v1(53.07,60.38) v1(53.07,59.13) v1(53.07,57.87) v1(53.07,56.61) v1(53.07,55.36) v1(53.22,29.52) v1(53.22,28.27) v1(53.4,41.78) v1(53.4,40.51) v1(53.66,20.95) v1(53.66,19.68) v1(54.23,52.19) v1(54.22,24.78) v1(54.36,66.67) v1(54.34,65.41) v1(54.34,64.15) v1(54.34,62.9) v1(54.34,61.64) v1(54.34,60.38) v1(54.34,59.13) v1(54.34,57.87) v1(54.34,56.61) v1(54.34,55.36) v1(54.34,29.52) v1(54.34,28.27) v1(55.38,73.52) v1(55.4,29.54) v1(55.4,28.29) v1(55.48,24.78) v1(55.63,66.67) v1(55.61,65.41) v1(55.61,64.15) v1(55.61,62.9) v1(55.61,61.64) v1(55.61,60.38) v1(55.61,59.13) v1(55.61,57.87) v1(55.61,56.61) v1(55.61,55.36) v1(55.88,49.27) v1(55.88,47.74) v1(56.26,72.63) v1(56.38,37.52) v1(56.38,35.15) v1(56.4,36.46) v1(56.4,34.09) v1(56.65,29.52) v1(56.65,28.27) v1(56.88,65.41) v1(56.88,64.15) v1(56.88,62.9) v1(56.88,61.64) v1(56.88,60.38) v1(56.88,59.13) v1(56.88,57.87) v1(56.88,56.61) v1(56.88,55.36) v1(56.9,66.67) v1(57.02,73.4) v1(57.65,37.52) v1(57.66,36.46) v1(57.65,35.15) v1(57.66,34.09) v1(57.74,29.59) v1(57.74,28.34) v1(58.17,66.67) v1(58.15,65.41) v1(58.15,64.15) v1(58.15,62.9) v1(58.15,61.64) v1(58.15,60.38) v1(58.15,59.13) v1(58.15,57.87) v1(58.15,56.61) v1(58.15,55.36) v1(58.17,50.78) v1(58.17,49.53) v1(58.67,74.67) v1(59.49,5.06) v1(59.49,3.79) v1(59.49,2.52) v1(59.49,1.25) v1(59.55,7.48) v1(59.55,6.21) v1(60.54,5.08) v1(60.54,3.81) v1(60.54,2.54) v1(60.54,1.27) v1(60.61,7.49) v1(60.61,6.22) v1(61.09,40.24) v1(61.09,38.99) v1(61.09,36.69) v1(61.09,35.43) v1(61.09,33.38) v1(61.09,32.13) v1(61.09,29.45) v1(61.09,28.19) v1(61.86,7.48) v1(61.86,6.21) v1(61.8,5.06) v1(61.8,3.79) v1(61.8,2.52) v1(61.8,1.25) v1(62.98,7.48) v1(62.98,6.21) v1(62.91,5.06) v1(62.91,3.79) v1(62.91,2.52) v1(62.91,1.25) v1(63.97,5.08) v1(63.97,3.81) v1(63.97,2.54) v1(63.97,1.27) v1(64.03,7.49) v1(64.03,6.22) v1(65.06,21.05) v1(65.06,19.79) v1(65.23,5.06) v1(65.23,3.79) v1(65.23,2.52) v1(65.23,1.25) v1(65.29,7.48) v1(65.29,6.21) v1(65.53,78.6) v1(66.03,64.89) v1(66.17,34.79) v1(66.28,7.48) v1(66.28,6.21) v1(66.22,5.06) v1(66.22,3.79) v1(66.22,2.52) v1(66.22,1.25) v1(66.32,21.03) v1(66.32,19.78) v1(67.06,54.47) v1(67.27,5.08) v1(67.27,3.81) v1(67.27,2.54) v1(67.27,1.27) v1(67.34,7.49) v1(67.34,6.22) v1(67.44,34.79) v1(67.43,21.03) v1(67.43,19.78) v1(68.49,21.05) v1(68.49,19.79) v1(68.53,5.06) v1(68.53,3.79) v1(68.53,2.52) v1(68.53,1.25) v1(68.59,7.48) v1(68.59,6.21) v1(68.83,34.79) v1(69.65,5.06) v1(69.65,3.79) v1(69.65,2.52) v1(69.65,1.25) v1(69.75,21.03) v1(69.75,19.78) v1(69.71,7.48) v1(69.71,6.21) v1(69.97,41.41) v1(69.98,40.36) v1(70.17,55.87) v1(70.17,54.73) v1(70.1,34.79) v1(70.48,51.61) v1(70.48,49.5) v1(70.49,50.55) v1(70.49,48.45) v1(70.61,45.96) v1(70.77,7.49) v1(70.77,6.22) v1(70.7,5.08) v1(70.7,3.81) v1(70.7,2.54) v1(70.7,1.27) v1(70.83,21.09) v1(70.83,19.84) v1(70.93,64.89) v1(71.24,41.41) v1(71.25,40.36) v1(71.44,55.87) v1(71.44,54.73) v1(71.5,32.12) v1(71.75,51.61) v1(71.76,50.55) v1(71.75,49.5) v1(71.76,48.45) v1(71.96,5.06) v1(71.96,3.79) v1(71.96,2.52) v1(71.96,1.25) v1(72.01,45.96) v1(72.02,7.48) v1(72.02,6.21) v1(72.26,66.73) v1(72.26,65.46) v1(72.26,64.32) v1(72.26,63.05) v1(72.39,31.23) v1(72.51,41.41) v1(72.52,40.36) v1(72.64,55.81) v1(72.64,54.66) v1(72.76,51.61) v1(72.78,50.55) v1(72.76,49.5) v1(72.78,48.45) v1(73.08,5.06) v1(73.08,3.79) v1(73.08,2.52) v1(73.08,1.25) v1(73.14,7.48) v1(73.14,6.21) v1(73.27,78.79) v1(73.29,77.73) v1(73.27,76.68) v1(73.29,75.62) v1(73.41,45.96) v1(73.49,66.8) v1(73.49,65.53) v1(73.49,64.39) v1(73.49,63.12) v1(73.53,36.19) v1(73.91,55.81) v1(73.91,54.66) v1(74.03,51.61) v1(74.05,50.55) v1(74.03,49.5) v1(74.05,48.45) v1(74.13,5.08) v1(74.13,3.81) v1(74.13,2.54) v1(74.13,1.27) v1(74.23,9.79) v1(74.23,8.52) v1(74.19,7.49) v1(74.19,6.22) v1(74.29,12.21) v1(74.29,10.94) v1(74.42,35.3) v1(74.81,66.78) v1(74.81,65.52) v1(74.81,64.37) v1(74.81,63.1) v1(74.8,45.96) v1(75.34,9.79) v1(75.34,8.52) v1(75.39,5.06) v1(75.39,3.79) v1(75.39,2.52) v1(75.39,1.25) v1(75.41,12.21) v1(75.41,10.94) v1(75.45,7.48) v1(75.45,6.21) v1(75.86,66.8) v1(75.86,65.53) v1(75.86,64.39) v1(75.86,63.12) v1(75.82,22.34) v1(76.32,80.06) v1(76.33,79) v1(76.32,77.95) v1(76.33,76.89) v1(76.47,12.22) v1(76.47,10.95) v1(76.4,9.81) v1(76.4,8.54) v1(76.57,7.48) v1(76.57,6.21) v1(76.5,5.06) v1(76.5,3.79) v1(76.5,2.52) v1(76.5,1.25) v1(77.34,35.93) v1(77.34,34.66) v1(77.34,33.26) v1(77.56,5.08) v1(77.56,3.81) v1(77.56,2.54) v1(77.56,1.27) v1(77.66,9.79) v1(77.66,8.52) v1(77.62,7.49) v1(77.62,6.22) v1(77.72,12.21) v1(77.72,10.94) v1(78.74,9.86) v1(78.74,8.59) v1(78.86,80.19) v1(78.87,79.13) v1(78.86,78.08) v1(78.87,77.02) v1(78.81,12.27) v1(78.81,11) v1(78.88,7.48) v1(78.88,6.21) v1(78.82,5.06) v1(78.82,3.79) v1(78.82,2.52) v1(78.82,1.25) v1(78.99,69.84) v1(79.39,13.78) v1(79.45,16.19) v1(79.45,14.93) v1(79.86,12.28) v1(79.86,11.01) v1(79.8,9.87) v1(79.8,8.6) v1(79.97,7.54) v1(79.97,6.27) v1(79.9,5.13) v1(79.9,3.86) v1(79.9,2.59) v1(79.9,1.32) v1(80.57,13.76) v1(80.63,16.17) v1(80.63,14.9) v1(80.75,35.67) v1(80.75,34.4) v1(80.75,33.13) v1(80.96,5.14) v1(80.96,3.87) v1(80.96,2.6) v1(80.96,1.33) v1(81.06,9.86) v1(81.06,8.59) v1(81.02,7.55) v1(81.02,6.28) v1(81.12,12.27) v1(81.12,11) v1(81.4,80.19) v1(81.41,79.13) v1(81.4,78.08) v1(81.41,77.02) v1(81.81,35.68) v1(81.81,34.41) v1(81.81,33.14) v1(82.17,9.86) v1(82.17,8.59) v1(82.24,12.27) v1(82.24,11) v1(82.28,7.54) v1(82.28,6.27) v1(82.21,5.13) v1(82.21,3.86) v1(82.21,2.59) v1(82.21,1.32) v1(82.32,53.2) v1(82.32,51.93) v1(82.32,50.66) v1(82.42,67.15) v1(82.43,66.09) v1(82.42,64.78) v1(82.43,63.72) v1(82.42,62.67) v1(82.43,61.61) v1(82.45,60.18) v1(82.45,58.91) v1(82.45,57.64) v1(82.55,28.06) v1(82.55,26.79) v1(82.55,25.52) v1(83.13,70.09) v1(83.38,53.21) v1(83.38,51.94) v1(83.38,50.67) v1(83.36,9.83) v1(83.36,8.56) v1(83.33,5.13) v1(83.33,3.86) v1(83.33,2.59) v1(83.33,1.32) v1(83.42,12.25) v1(83.42,10.98) v1(83.39,7.54) v1(83.39,6.27) v1(83.5,60.2) v1(83.5,58.92) v1(83.5,57.66) v1(83.69,67.15) v1(83.69,64.78) v1(83.69,62.67) v1(83.7,66.09) v1(83.7,63.72) v1(83.7,61.61) v1(83.94,80.19) v1(83.95,79.13) v1(83.94,78.08) v1(83.95,77.02) v1(83.95,28.06) v1(83.95,26.79) v1(83.95,25.52) v1(84.18,70.1) v1(84.2,30.47) v1(84.39,5.14) v1(84.39,3.87) v1(84.39,2.6) v1(84.39,1.33) v1(84.43,53.2) v1(84.43,51.93) v1(84.43,50.66) v1(84.47,9.83) v1(84.47,8.56) v1(84.45,7.55) v1(84.45,6.28) v1(84.54,12.25) v1(84.54,10.98) v1(84.82,60.18) v1(84.82,58.91) v1(84.82,57.64) v1(84.96,67.15) v1(84.97,66.09) v1(84.96,64.78) v1(84.97,63.72) v1(84.96,62.67) v1(84.97,61.61) v1(85.24,70.09) v1(85.49,53.21) v1(85.49,51.94) v1(85.49,50.67) v1(85.64,5.13) v1(85.64,3.86) v1(85.64,2.59) v1(85.64,1.32) v1(85.71,7.54) v1(85.71,6.27) v1(85.88,60.2) v1(85.88,58.92) v1(85.88,57.66) v1(86.1,67.15) v1(86.11,66.09) v1(86.1,64.78) v1(86.11,63.72) v1(86.1,62.67) v1(86.11,61.61) v1(86.23,30.98) v1(86.29,70.1) v1(86.74,19.55) v1(86.8,53.2) v1(86.8,51.93) v1(86.8,50.66) v1(86.85,36.56) v1(86.85,35.29) v1(86.85,34.02) v1(86.99,76.5) v1(86.99,74.39) v1(86.93,60.18) v1(86.93,58.91) v1(86.93,57.64) v1(87,75.45) v1(87,73.34) v1(87.37,67.15) v1(87.38,66.09) v1(87.37,64.78) v1(87.38,63.72) v1(87.37,62.67) v1(87.38,61.61) v1(87.63,30.98) v1(87.86,53.21) v1(87.86,51.94) v1(87.86,50.67) v1(87.99,60.2) v1(87.99,58.92) v1(87.99,57.66) v1(87.91,36.57) v1(87.91,35.3) v1(87.91,34.03) v1(88.01,17.9) v1(88.01,16.37) v1(88.21,3.55) v1(88.21,2.28) v1(88.21,1.01) v1(88.38,76.63) v1(88.38,74.52) v1(88.4,75.57) v1(88.4,73.46) v1(88.93,52.18) v1(88.93,50.91) v1(88.93,49.64) v1(89.17,36.56) v1(89.17,35.29) v1(89.17,34.02) v1(89.47,3.54) v1(89.47,2.27) v1(89.47,1) v1(89.78,76.38) v1(89.78,74.27) v1(89.8,75.32) v1(89.8,73.21) v1(89.98,52.19) v1(89.98,50.92) v1(89.98,49.65) v1(90.16,36.56) v1(90.16,35.29) v1(90.3,68.19) v1(90.58,3.54) v1(90.58,2.27) v1(90.58,1) v1(91.03,52.18) v1(91.03,50.91) v1(91.03,49.64) v1(91.18,22.23) v1(91.21,36.57) v1(91.21,35.3) v1(91.19,21.18) v1(91.64,3.55) v1(91.64,2.28) v1(91.64,1.01) v1(91.82,79.11) v1(91.82,78.22) v1(92.09,52.19) v1(92.09,50.92) v1(92.09,49.65) v1(92.47,36.56) v1(92.47,35.29) v1(92.45,22.23) v1(92.46,21.18) v1(92.58,19.69) v1(92.59,18.64) v1(92.84,79.11) v1(92.84,78.22) v1(92.84,77.21) v1(92.89,3.54) v1(92.89,2.27) v1(92.89,1) v1(93.07,48.69) v1(93.07,47.42) v1(93.07,46.15) v1(93.07,44.75) v1(93.07,43.48) v1(93.07,42.21) v1(93.41,52.18) v1(93.41,50.91) v1(93.41,49.64) v1(93.46,17.25) v1(93.46,15.99) v1(93.46,14.72) v1(93.58,13.42) v1(93.58,12.15) v1(93.58,10.88) v1(93.72,22.23) v1(93.73,21.18) v1(93.85,19.69) v1(93.86,18.64) v1(94.12,48.7) v1(94.12,47.43) v1(94.12,46.16) v1(94.12,44.76) v1(94.12,43.49) v1(94.12,42.22) v1(94.46,52.19) v1(94.46,50.92) v1(94.46,49.65) v1(94.52,17.27) v1(94.52,16) v1(94.52,14.73) v1(94.63,13.44) v1(94.63,12.17) v1(94.63,10.9) v1(95.18,48.69) v1(95.18,47.42) v1(95.18,46.15) v1(95.18,44.75) v1(95.18,43.48) v1(95.18,42.21) v1(95.12,19.69) v1(95.13,18.64) v1(95.62,8.39) v1(95.64,7.34) v1(95.77,17.25) v1(95.77,15.99) v1(95.77,14.72) v1(96.13,13.34) v1(96.15,12.29) v1(96.23,48.7) v1(96.23,47.43) v1(96.23,46.16) v1(96.23,44.76) v1(96.23,43.49) v1(96.23,42.22) v1(96.23,41.21) v1(96.23,39.94) v1(96.23,38.67) v1(96.27,33.07) v1(96.27,31.8) v1(96.27,30.53) v1(96.27,29.14) v1(96.27,27.87) v1(96.76,17.25) v1(96.76,15.99) v1(96.76,14.72) v1(96.89,8.39) v1(96.91,7.34) v1(97.4,13.34) v1(97.42,12.29) v1(97.55,48.69) v1(97.55,47.42) v1(97.55,46.15) v1(97.55,44.75) v1(97.55,43.48) v1(97.55,42.21) v1(97.55,41.19) v1(97.55,39.92) v1(97.55,38.65) v1(97.64,33) v1(97.64,31.73) v1(97.64,30.46) v1(97.64,29.07) v1(97.64,27.8) v1(97.64,26.53) v1(97.64,25.51) v1(97.64,24.24) v1(97.64,22.97) v1(97.82,17.27) v1(97.82,16) v1(97.82,14.73) v1(98.16,8.39) v1(98.18,7.34) v1(98.6,48.7) v1(98.6,47.43) v1(98.6,46.16) v1(98.6,44.76) v1(98.6,43.49) v1(98.6,42.22) v1(98.6,41.21) v1(98.6,39.94) v1(98.6,38.67) v1(98.67,13.34) v1(98.69,12.29) v1(98.7,33.02) v1(98.7,31.75) v1(98.7,30.48) v1(98.7,29.08) v1(98.7,27.81) v1(98.7,26.54) v1(98.7,25.52) v1(98.7,24.25) v1(98.7,22.98) v1(99.07,17.25) v1(99.07,15.99) v1(99.07,14.72) v2(4.95,39.11) v2(4.97,35.55) v2(4.95,31.99) v2(5.06,21.9) v2(5.08,18.34) v2(5.06,14.79) v2(8.38,39.11) v2(8.38,31.99) v2(8.4,35.55) v2(8.49,21.9) v2(8.51,18.34) v2(8.49,14.79) v2(11.81,39.11) v2(11.8,35.55) v2(11.81,31.87) v2(11.92,21.9) v2(11.9,18.34) v2(11.92,14.66)
VCC3V: length 322.9
  Top Layer w0.299: 100nf#4.1 39.35,54.47 41.91,54.47 42.45,55.01 677.100 ; 48.94,51.81 48.94,53.46 ; 48.94,51.81 47.79,50.66 45.61,50.66 100nf#6.1 ; 48.94,51.81 50.93,51.81 51.44,52.32 51.44,53.46 ; 0.1 61.91,48.45 100nf#8.1 60.02,48.5 57.66,48.5 57.28,48.89 57.28,51.04 56.26,52.06 55.75,52.06 55.44,52.38 55.44,53.46 ; 63.63,66.68 63.3,67.01 677.50 ; 100nf#5.1 44.45,70.73 44.96,70.22 46.1,70.22 46.44,69.89 677.75 ; 100nf#9.2 64.64,56.01 677.28
  Top Layer w0.508: U5.4 v4(17.85,42.41) ; H10.2 87.9,82.14 100NF15.2 ; v4(94.36,57.78) v4(94.36,64.51) v4(94.36,73.52) ; 10k.2 84.47,45.2 77.85,45.2 v3(77.47,45.58)
  Top Layer w0.762: 39.31,51.75 v3(32.57,51.75) 18.16,51.75 ; 39.31,51.75 44.49,51.75 100nf#6.1 ; 39.31,51.75 100nf#4.1 ; 64.74,53.46 v3(75.44,53.46) ; 64.74,53.46 v3(60.07,53.46) ; 64.74,53.46 64.74,57.42 v3(64.64,57.52) ; 40.39,72.02 37.99,72.02 v3(32.64,66.67) ; 40.39,72.02 100nf#5.1 ; 40.39,72.02 v3(40.39,75.68) ; v3(82.55,40.25) 86.79,40.25 100nf#3.1 90.29,40.04 CN4.1 ; 100nf#8.1 60.07,48.45 v3(60.07,48.5) ; 100nf7.2 17.91,51.66 17.91,45.33 ; v3(59.52,75.7) 59.52,74.97 60.84,73.64 60.84,70.98 64.02,67.79 C37.1 64.02,65.51 64.52,65.01
  Top Layer w1.016: U5.2 U5.4
  Bottom Layer w0.508: H10.2 87.76,82.29 87.76,80.13 v4(94.36,73.52) 94.36,70.08 10K6.1 ; 10.29,6.21 10.54,6.47 10.54,9.9 11.68,11.04 17.02,11.04 17.91,11.93 17.91,42.41 v4(17.85,42.41) ; v4(94.36,57.78) 10k1.1 ; v4(94.36,64.51) 94.36,63.22
  Bottom Layer w0.762: v3(64.64,65.01) v3(64.64,57.52) ; v3(32.57,51.75) 32.64,51.82 v3(32.64,66.67) ; v3(40.39,75.68) 59.5,75.68 v3(59.52,75.7) ; v3(60.07,53.46) v3(60.07,48.5) ; v3(82.55,40.25) 82.55,40.5 v3(77.47,45.58) 75.44,47.61 v3(75.44,53.46) 75.44,55.23 76.31,56.11 10k1.1
  Bottom Layer w1.016: 10.58,1.9 10.56,1.92 2K#3.1 100NF#5.2
  Bottom Layer w1.778: P5.2 P5.1
VCC5V: length 294
  Top Layer w1.27: 25.78,38.6 32.12,38.6 100nf8.2 36.56,38.74 C39.1 ; 37.85,44.5 37.85,45.71 36.19,47.36 32.25,47.36 ; 37.85,44.5 32.26,44.5 ; 37.85,44.5 C39.1 ; v2(68.58,65.01) 68.58,67.43 63.75,72.25 63.75,77.71 H11.1 ; 33uH1.2 24.23,37.25 2.4 ; U5.3 23.81,47.36 32.25,47.36 ; 100nf14.1 59.56,26.14 v2(59.56,31.11) TB2.13 44.2,31.11 C39.1 ; 32.25,47.36 32.25,47.36 ; 电机A3.4 23.75,70.44 23.75,62.47 21.59,60.31 P1.3
  Bottom Layer w1.016: P4.1 20.84,2.64 5K.1 100NF#6.2
  Bottom Layer w1.27: 7.13,44.69 7.24,44.81 7.24,60.57 ; 7.13,44.69 7.1,44.69 ; 7.13,44.69 20.96,44.69 ; 68.58,43.55 61.59,43.55 59.56,41.52 v2(59.56,31.11) ; 68.58,43.55 74.68,43.55 78.61,39.61 78.61,25.52 80.25,23.88 86.49,23.88 ; 68.58,43.55 v2(68.58,65.01) ; 20.96,44.69 20.96,7.4 ; 20.96,44.69 32,44.69 v2(32.26,44.44) ; 7.1,44.69 P2.3 ; 7.1,44.69 100nf22.2 ; 100nf15.1 7.1,60.31 P1.3
  Bottom Layer w1.778: P4.2 P4.1
  vias: v3(23.91,75.55) v3(23.91,74.16) v3(25.44,75.55) v3(25.44,74.16) v4(93.26,24.12) v4(94.74,25.39) v4(94.74,24.12) v4(95.95,25.39) v4(95.97,24.12)
VCC7.4V: length 64.5
  Top Layer w1.27: U6.2 U6.5 U6.8 U6.11 43.89,4.12 100nf16.2 ; 28.96,21.71 28.96,11.34 33uH2.2 ; 24.5,21.99 31.07,21.99 100nf11.2 37.48,21.82 C40.1 v2(37.85,18.53)
  Bottom Layer w1.27: v2(37.85,18.53) 37.85,10.15 43.88,4.12 U6.11 U6.8 U6.5 U6.2
VCC12V: length 120
  Top Layer w1.778: 100nf9.2 v2(35.29,12.69) ; 100nf9.2 35.29,7.47 FU2.1 35.24,2.09 P3.2 ; 100nf9.2 60.2,10.4 S1.3 ; v2(35.31,27.93) 27.82,27.93 FU1.1
  Bottom Layer w1.016: 100NF1.2 31.13,2.39 P3.1
  Bottom Layer w1.778: P3.2 P3.1 ; 35.31,12.69 v2(35.29,12.69) 35.29,27.91 ; v2(35.31,27.93) 35.29,27.91 ; 35.29,27.91 35.05,28.15 35.05,45.33 30.61,49.77 21.72,49.77 18.8,52.7 18.8,70.43 电机A3.6
  vias: v3(18.29,75.56) v3(18.29,74.16) v3(19.81,75.56) v3(19.81,74.16) v3(21.37,75.56) v3(21.34,74.16)
AO1: length 40.3
  Bottom Layer w1.27: TB2.4 70.49,31.11 72.77,28.82 72.77,22.09 74.42,20.44 83.95,20.44 86.74,17.64 86.74,14.85 88.01,13.58 90.39,13.58 CN19.2
AO2: length 39.2
  Bottom Layer w1.27: TB2.5 72.26,33.64 75.31,30.6 75.31,24.75 77.85,22.22 86.09,22.22 90.41,17.9 CN19.1
BO1: length 44.3
  Top Layer w1.27: CN20.2 90.41,17.9 85.71,22.6 78.36,22.6 76.2,24.75 76.2,35.8 73.28,38.73 TB2.7
BO2: length 44.9
  Top Layer w1.27: CN20.1 90.39,13.58 88.01,13.58 86.74,14.85 86.74,17.64 83.95,20.44 75.95,20.44 73.66,22.72 73.66,33.77 71.25,36.19 TB2.6
LED2_PC4: length 8.7
  Top Layer w0.254: 677.33 67.98,58.51 2K#2.1
LED3_PC5: length 9.9
  Top Layer w0.254: 2K.1 68.47,59.45 68.04,59.01 677.34
OSC_IN: length 10.5
  Top Layer w0.254: 1M.1 51.18,46.2 49.15,46.2 50.15,47.2 X1.1 51.94,51.18 51.94,53.46
OSC_OUT: length 10.5
  Top Layer w0.254: 52.44,53.46 52.44,51.2 X1.2 54.25,47.2 55.25,46.2 53.21,46.2 1M.2
PA12: length 20.9
  Top Layer w0.254: 677.71 48.44,70.02 v1(48.9,70.48) ; 电机A3.1 33.42,70.46 v1(33.53,70.35) ; v1(38.61,70.09) 38.99,70.48 v1(41.91,70.48)
  Bottom Layer w0.254: v1(41.91,70.48) v1(48.9,70.48) ; v1(33.53,70.35) 34.8,69.08 37.59,69.08 v1(38.61,70.09)
PA15: length 23.6
  Top Layer w0.254: 电机A3.3 26.29,70.44 26.29,66.67 27.69,65.27 v1(41.91,65.27) ; v1(43.31,66.67) 43.46,66.51 677.77
  Bottom Layer w0.254: v1(43.31,66.67) v1(41.91,65.27)
PB8: length 37.6
  Top Layer w0.254: v1(37.97,57.51) 677.95 ; TB2.12 44.7,33.64 43.31,35.04 v1(42.04,35.04)
  Bottom Layer w0.254: v1(37.97,57.51) 37.97,41.65 41.28,38.34 41.28,35.8 v1(42.04,35.04)
PB10: length 52
  Top Layer w0.254: 677.47 61.1,65.51 61.34,65.27 61.34,64.25 v1(61.98,63.62) ; v1(53.34,39.61) v1(53.34,32.5)
  Bottom Layer w0.254: v1(53.34,39.61) 54.61,39.61 63.12,48.12 63.12,62.47 v1(61.98,63.62) ; TB2.16 49.66,23.48 50.42,24.25 50.42,29.58 v1(53.34,32.5)
PB11: length 40.3
  Top Layer w0.254: 677.48 61.49,66.01 61.85,65.65 61.85,64.63 v1(62.74,63.74)
  Bottom Layer w0.254: TB2.10 54.86,38.73 63.75,47.61 63.75,62.73 v1(62.74,63.74)
PB51: length 39.7
  Top Layer w0.254: 677.51 58.44,71 58.8,71.36 v1(59.31,71.36)
  Bottom Layer w0.254: v1(59.31,71.36) 83.95,71.36 85.22,72.63 85.22,82.29 H10.3
PB52: length 37.2
  Top Layer w0.254: 677.52 57.94,71.26 58.8,72.13 v1(59.31,72.13)
  Bottom Layer w0.254: v1(59.31,72.13) 81.03,72.13 82.68,73.78 82.68,82.29 H10.4
PB53: length 32.7
  Top Layer w0.254: v1(59.31,72.89) 58.8,72.89 57.44,71.52 677.53
  Bottom Layer w0.254: H10.6 77.6,82.29 77.6,73.78 76.71,72.89 v1(59.31,72.89)
PB54: length 30.6
  Top Layer w0.254: v1(59.31,73.65) 58.67,73.65 56.94,71.91 677.54
  Bottom Layer w0.254: v1(59.31,73.65) 74.3,73.65 75.06,74.41 75.06,82.29 H10.7
PC6: length 14.9
  Top Layer w0.254: H11.3 58.29,75.3 57.78,74.79 52.83,74.79 52.44,74.4 677.63
PC7: length 12.7
  Top Layer w0.254: H11.4 55.75,75.81 55.25,75.3 52.58,75.3 51.94,74.66 677.64
PC8: length 10.6
  Top Layer w0.254: H11.5 53.21,76.19 52.83,75.81 52.2,75.81 51.44,75.05 677.65
PC9: length 9.6
  Top Layer w0.254: 677.66 50.94,77.83 H11.6
PC10: length 66.1
  Top Layer w0.254: v1(43.81,68.57) 43.33,68.57 42.42,67.66 42.42,66.54 42.94,66.01 677.78
  Bottom Layer w0.254: RESET2.2 RESET2.1 90.81,62.43 90.81,66.67 89.08,68.39 43.99,68.39 v1(43.81,68.57)
PC11: length 63.1
  Top Layer w0.254: v1(44.32,69.2) 42.8,69.2 41.91,68.32 41.91,66.28 42.68,65.51 677.79
  Bottom Layer w0.254: v1(44.32,69.2) 44.58,68.95 91.15,68.95 RESET3.1 RESET3.2
PC12: length 42
  Top Layer w0.254: v1(42.04,36.19) TB2.11 ; 677.80 42.92,65.01 42.42,64.51 v1(38.74,64.51)
  Bottom Layer w0.254: v1(38.74,64.51) 38.74,41.77 42.04,38.47 v1(42.04,36.19)
PD1: length 53.5
  Top Layer w0.254: TB2.15 v1(42.04,26.03) ; 677.82 39.38,64.01 38.99,63.62 v1(37.72,63.62)
  Bottom Layer w0.254: v1(37.72,63.62) 36.7,62.6 36.7,41.01 40,37.71 40,34.92 41.28,33.64 41.28,26.79 v1(42.04,26.03)
PD2: length 48.9
  Top Layer w0.254: 677.83 39.77,63.51 v1(38.1,61.84) ; v1(42.04,28.56) TB2.14
  Bottom Layer w0.254: v1(42.04,28.56) 42.04,33.9 40.64,35.3 40.64,37.96 37.34,41.27 37.34,57.9 38.1,58.66 v1(38.1,61.84)
PE0: length 59.4
  Top Layer w0.254: 677.97 v1(1.27,56.51)
  Bottom Layer w0.254: v1(1.27,56.51) 1.27,69.71 2.03,70.48 P1.1
PE1: length 41.8
  Top Layer w0.254: P2.1 4.71,56.01 677.98
PE8: length 67.8
  Top Layer w0.254: v1(45.21,46.22) 40.77,50.66 v1(34.93,50.66) ; v1(61.72,61.2) 61.41,61.51 677.39
  Bottom Layer w0.254: v1(61.72,61.2) 61.72,48.5 57.28,44.06 46.48,44.06 45.21,45.33 v1(45.21,46.22) ; v1(34.93,50.66) 34.93,66.8 电机A2.6
PE9: length 74
  Top Layer w0.254: v1(62.36,62.01) 677.40 ; v1(44.45,45.96) 41.02,49.39 v1(35.31,49.39)
  Bottom Layer w0.254: v1(35.31,49.39) 33.27,49.39 26.27,56.4 电机A2.4 ; v1(62.36,62.01) 62.36,48.25 57.53,43.42 46.48,43.42 44.45,45.46 v1(44.45,45.96)
PWMA: length 27.9
  Top Layer w0.254: 677.67 50.44,70.71 v1(50.04,71.11) ; v1(38.48,70.98) 38.61,71.11 v1(42.67,71.11)
  Bottom Layer w0.254: v1(42.67,71.11) v1(50.04,71.11) ; 电机A2.5 28.83,70.52 28.83,72.63 30.1,73.9 34.04,73.9 36.96,70.98 v1(38.48,70.98)
PWMB: length 25.9
  Top Layer w0.254: v1(37.59,69.97) 38.35,69.2 v1(41.78,69.2) ; v1(49.66,69.84) 49.94,69.56 677.68 ; v1(30.48,73.14) 28.77,71.43 电机A3.2
  Bottom Layer w0.254: v1(49.66,69.84) 42.42,69.84 v1(41.78,69.2) ; v1(37.59,69.97) 36.7,69.97 33.53,73.14 v1(30.48,73.14)
RESET: length 85.3
  Top Layer w0.254: H10.5 80.14,82.29 v1(80.14,54.13) 80.14,48.38 78.87,47.11 59.06,47.11 58.55,47.61 57.06,47.61 56.64,48.03 56.64,50.79 55.88,51.55 53.72,51.55 52.94,52.34 52.94,53.46
  Bottom Layer w0.254: RESET1.2 RESET1.1 v1(80.14,54.13)
STEER1: length 87.4
  Top Layer w0.254: v1(55.12,71.75) 54.44,71.06 677.59
  Bottom Layer w0.254: U6.1 53.97,6.69 53.97,14.04 44.7,23.31 44.7,39.74 41.09,43.35 41.09,70.93 41.91,71.75 v1(55.12,71.75)
STEER2: length 87.6
  Top Layer w0.254: v1(54.48,72.38) 53.94,71.83 677.60
  Bottom Layer w0.254: v1(54.48,72.38) 41.53,72.38 40.56,71.41 40.56,43.07 44.07,39.56 44.07,22.98 51.47,15.58 U6.4
STEER3: length 87.8
  Top Layer w0.254: v1(53.85,73.02) 53.44,72.6 677.61
  Bottom Layer w0.254: U6.7 48.93,17.06 43.43,22.55 43.43,39.23 40,42.66 40,71.87 41.15,73.02 v1(53.85,73.02)
STEER4: length 88.1
  Top Layer w0.254: 677.62 52.94,73.37 v1(53.21,73.65)
  Bottom Layer w0.254: v1(53.21,73.65) 40.77,73.65 39.37,72.25 39.37,42.28 42.8,38.85 42.8,21.96 46.38,18.38 U6.10
SWCLK: length 69.5
  Top Layer w0.254: v1(43.43,67.81) 43.43,67.43 43.85,67.01 677.76 ; v1(86.85,49.52) 10k#2.1 90.34,47.36 CN4.4 ; v1(78.99,67.81) v1(78.99,49.52)
  Bottom Layer w0.254: v1(78.99,67.81) v1(43.43,67.81) ; v1(86.85,49.52) v1(78.99,49.52)
SWDIO: length 76.6
  Top Layer w0.254: v1(48.39,74.41) 47.94,73.96 677.72 ; CN4.3 90.3,44.82 10k.1 86.87,44.84 86.87,45.84 86.61,46.09 81.79,46.09 81.15,46.73 v1(81.15,70.73)
  Bottom Layer w0.254: v1(48.39,74.41) 57.91,74.41 58.55,73.78 58.55,71.11 58.93,70.73 v1(81.15,70.73)
USART1_RX: length 77.4
  Top Layer w0.254: v1(83.44,29.33) 90.39,29.33 CN15.3 ; 677.93 43.59,58.51 v1(43.31,58.79) ; v1(43.94,44.95) 44.45,44.44 83.06,44.44 v1(83.44,44.06)
  Bottom Layer w0.254: v1(43.94,44.95) 43.31,45.58 v1(43.31,58.79) ; v1(83.44,44.06) v1(83.44,29.33)
USART1_TX: length 77.6
  Top Layer w0.254: 677.92 43.98,59.01 v1(42.93,60.06) ; v1(84.2,43.42) 82.68,43.42 82.3,43.81 44.07,43.81 v1(43.69,44.19) ; v1(84.07,31.87) 90.35,31.87 CN15.4
  Bottom Layer w0.254: v1(84.2,43.42) 84.2,31.99 v1(84.07,31.87) ; v1(43.69,44.19) 42.67,45.2 42.67,59.81 v1(42.93,60.06)
USART2_RX: length 81
  Top Layer w0.254: v1(42.55,61.46) 42.6,61.51 677.87 ; v1(43.43,43.42) 43.69,43.17 81.66,43.17 82.04,42.79 v1(84.96,42.79)
  Bottom Layer w0.254: v1(43.43,43.42) 42.16,44.69 42.16,61.08 v1(42.55,61.46) ; v1(84.96,42.79) 84.96,30.6 85.85,29.71 90.01,29.71 CN18.2
USART2_TX: length 80.4
  Top Layer w0.254: v1(43.18,42.66) 43.31,42.53 81.28,42.53 81.66,42.15 v1(85.6,42.15) ; 677.86 42.88,62.01 v1(42.55,62.35)
  Bottom Layer w0.254: CN18.1 89.97,32.25 86.49,32.25 85.6,33.14 v1(85.6,42.15) ; v1(43.18,42.66) 41.66,44.19 41.66,61.84 42.16,62.35 v1(42.55,62.35)
USART3_RX: length 58.3
  Top Layer w0.254: v1(55.63,69.97) 55.94,69.66 677.56 ; v1(78.11,69.59) v1(78.11,48.25)
  Bottom Layer w0.254: v1(55.63,69.97) 56.13,69.46 77.98,69.46 v1(78.11,69.59) ; v1(78.11,48.25) 78.93,47.43 CN17.1
USART3_TX: length 60.2
  Top Layer w0.254: v1(56.01,70.73) 56.44,70.3 677.55 ; v1(76.96,48.25) v1(76.96,70.09)
  Bottom Layer w0.254: v1(56.01,70.73) 56.64,70.09 v1(76.96,70.09) ; v1(76.96,48.25) 80.28,44.93 CN17.2
$1N4303: length 2.3
  Bottom Layer w1.016: 5K.2 25.11,4.94 LED2.2
$1N4305: length 2.3
  Bottom Layer w1.016: 2K#3.2 14.82,4.94 LED1.2
$1N4501: length 2.5
  Top Layer w0.254: 72.99,60.56 72.92,60.64 2K.2
$1N4502: length 2.5
  Top Layer w0.254: 2K#2.2 72.99,58.02 PC4.2
$1N4552: length 13.9
  Top Layer w0.254: 0.2 62.36,51.68 62.05,51.99 57.35,51.99 56.96,52.38 56.96,53.38
  Top Layer w0.762: 100NF.2 106.2 2.2u#3.2 0.2
$1N4554: length 3.8
  Top Layer w0.254: 2.2u.2 47.44,71.06 677.73
$1N4555: length 6.6
  Top Layer w0.254: 2.2u#2.2 64.27,63.11 62.36,65.02 62.36,66.16 62,66.51 677.49
$1N11019: length 4.7
  Top Layer w0.254: 677.94 41.28,58.01 10K.1
$1N28449: length 9.6
  Top Layer w1.27: FU1.2 19.49,28 18.03,29.45 18.03,32.09 2.1
$1N28458: length 15.1
  Top Layer w1.27: 2.2 23.97,33.85 33uH1.1 31.64,32.3 SS34.1
$1N28460: length 20
  Top Layer w1.27: 5.1 18.16,14.86 18.16,9.26 20,7.42 FU2.2
$1N28462: length 8.5
  Top Layer w1.27: 100nf10.1 26.55,19.98 5.4
$1N28463: length 9.8
  Top Layer w1.27: 5.2 22.49,16.58 ss34.1 22.65,16.51 33uH2.1
$1N28554: length 2.4
  Bottom Layer w1.016: LED3.2 43.52,1.75 2K1.2

## Copper pours and planes (outline as drawn; the poured copper is in the pictures)
GND on Top Layer: -27.81,115.05 108.97,115.05 108.97,-9.79 -27.81,-9.79
GND on Bottom Layer: -6.98,88.89 139.32,88.89 139.32,-27.19 -6.98,-27.19
VCC5V on Top Layer: 22.8,76.31 24.81,76.31 24.81,68.2 22.8,68.2
VCC5V on Top Layer: 24.05,76.31 26.76,76.31 26.76,73.27 24.05,73.27
VCC5V on Top Layer: 58.88,27.13 64.59,27.13 64.59,25.07 58.88,25.07
VCC5V on Top Layer: 85.94,26.05 96.7,26.05 96.7,23.36 85.94,23.36
VCC5V on Bottom Layer: 85.92,26.05 96.68,26.05 96.68,23.36 85.92,23.36
VCC5V on Bottom Layer: 24.04,76.31 26.75,76.31 26.75,73.26 24.04,73.26
VCC5V on Bottom Layer: 22.79,76.31 24.8,76.31 24.8,68.19 22.79,68.19
VCC5V on Bottom Layer: 86.08,40.94 96.29,40.94 96.29,25.17 86.08,25.17
VCC12V on Top Layer: 14.03,71.62 17.66,71.62 17.66,68.28 14.03,68.28
VCC12V on Top Layer: 17.53,76.32 19.94,76.32 19.94,68.32 17.53,68.32
VCC12V on Top Layer: 19.68,76.32 22.23,76.32 22.23,73.27 19.68,73.27
VCC12V on Top Layer: 57.45,24.63 64.64,24.63 64.64,8.88 57.45,8.88
VCC12V on Bottom Layer: 14.01,71.63 17.64,71.63 17.64,68.29 14.01,68.29
VCC12V on Bottom Layer: 17.53,76.32 19.94,76.32 19.94,68.32 17.53,68.32
VCC12V on Bottom Layer: 19.68,76.32 22.23,76.32 22.23,73.27 19.68,73.27
POWER12V on Bottom Layer: 63.65,17.77 66.42,17.77 66.42,8.75 63.65,8.75
$1N4552 on Top Layer: 56.25,54.27 57.12,54.27 57.12,52.64 56.25,52.64
$1N28468 on Bottom Layer: 67.92,18.41 78.61,18.41 78.61,13.83 67.92,13.83

Small or netless copper shapes (teardrops, artwork), in the pictures only: 284 on Top Layer, 169 on Bottom Layer

## Text on the board
Bottom Silkscreen Layer: 100NF | 2K | 5K | 10K
Top Silkscreen Layer: GND | PE0 | PE1 | 5V | 12V | PE9 | PA15 | PWMA / PA8 | PWMB / PA9 | PE8 | PA12 | PC9 | PC8 | PC7 | PC6 | 3V | 100NF | 330UH | 10K | 22PF | PB10 | PD2 | PD1 | PC12 | PB8 | PB11 | 1M | 7.4 | 2K | 2.2UF | SWCLK | SWDIO | 1_TX | 1_RX | PC5 | PC4 | 3_RX | 3_TX | 2_TX | 2_RX | LM2596-5V | LM2596-ADJ | 220UF | PD15 | PD14 | PD13 | PD12 | 680UF | 0Ω | 10UF | PC11 | PC10 | 33UH | BO2 | BO1 | AO2 | AO1 | 1K | 5K | 正 | 反 | 复位
